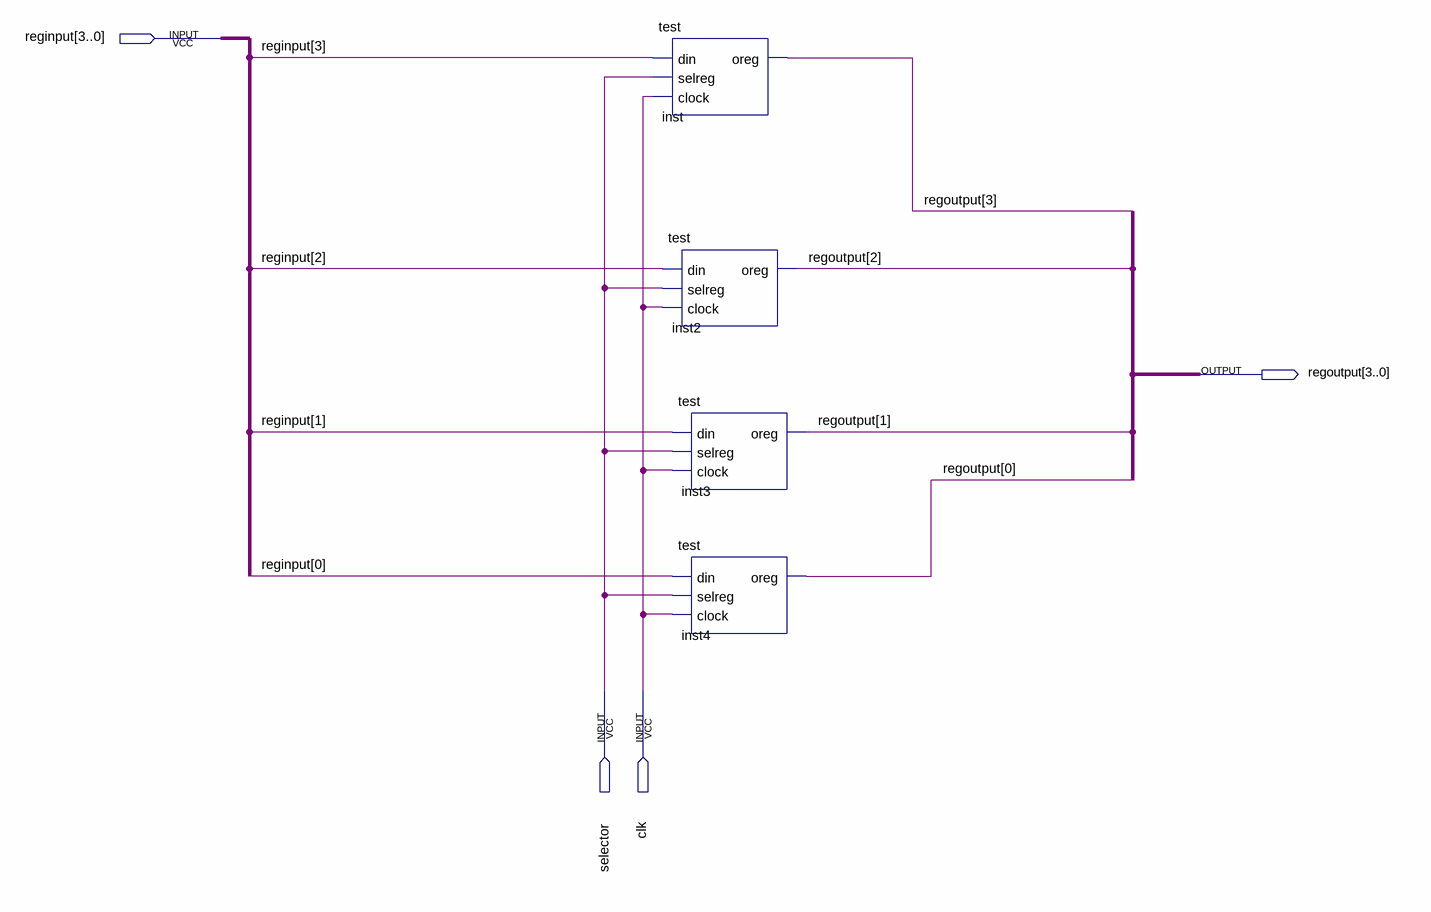
[diagram p0: schematic sheet]
// Quartus schematic register.bdf as structural Verilog: 4 symbols, 4 pins
module register (
  input  [3:0] reginput,
  input  selector,
  input  clk,
  output [3:0] regoutput
);

  test inst (.din(reginput[3]), .selreg(selector), .clock(clk), .oreg(regoutput[3]));
  test inst2 (.din(reginput[2]), .selreg(selector), .clock(clk), .oreg(regoutput[2]));
  test inst3 (.din(reginput[1]), .selreg(selector), .clock(clk), .oreg(regoutput[1]));
  test inst4 (.din(reginput[0]), .selreg(selector), .clock(clk), .oreg(regoutput[0]));
endmodule
